# Altium schematic sheet QuadOPTOascii.SchDoc
size 513 x 386 mm
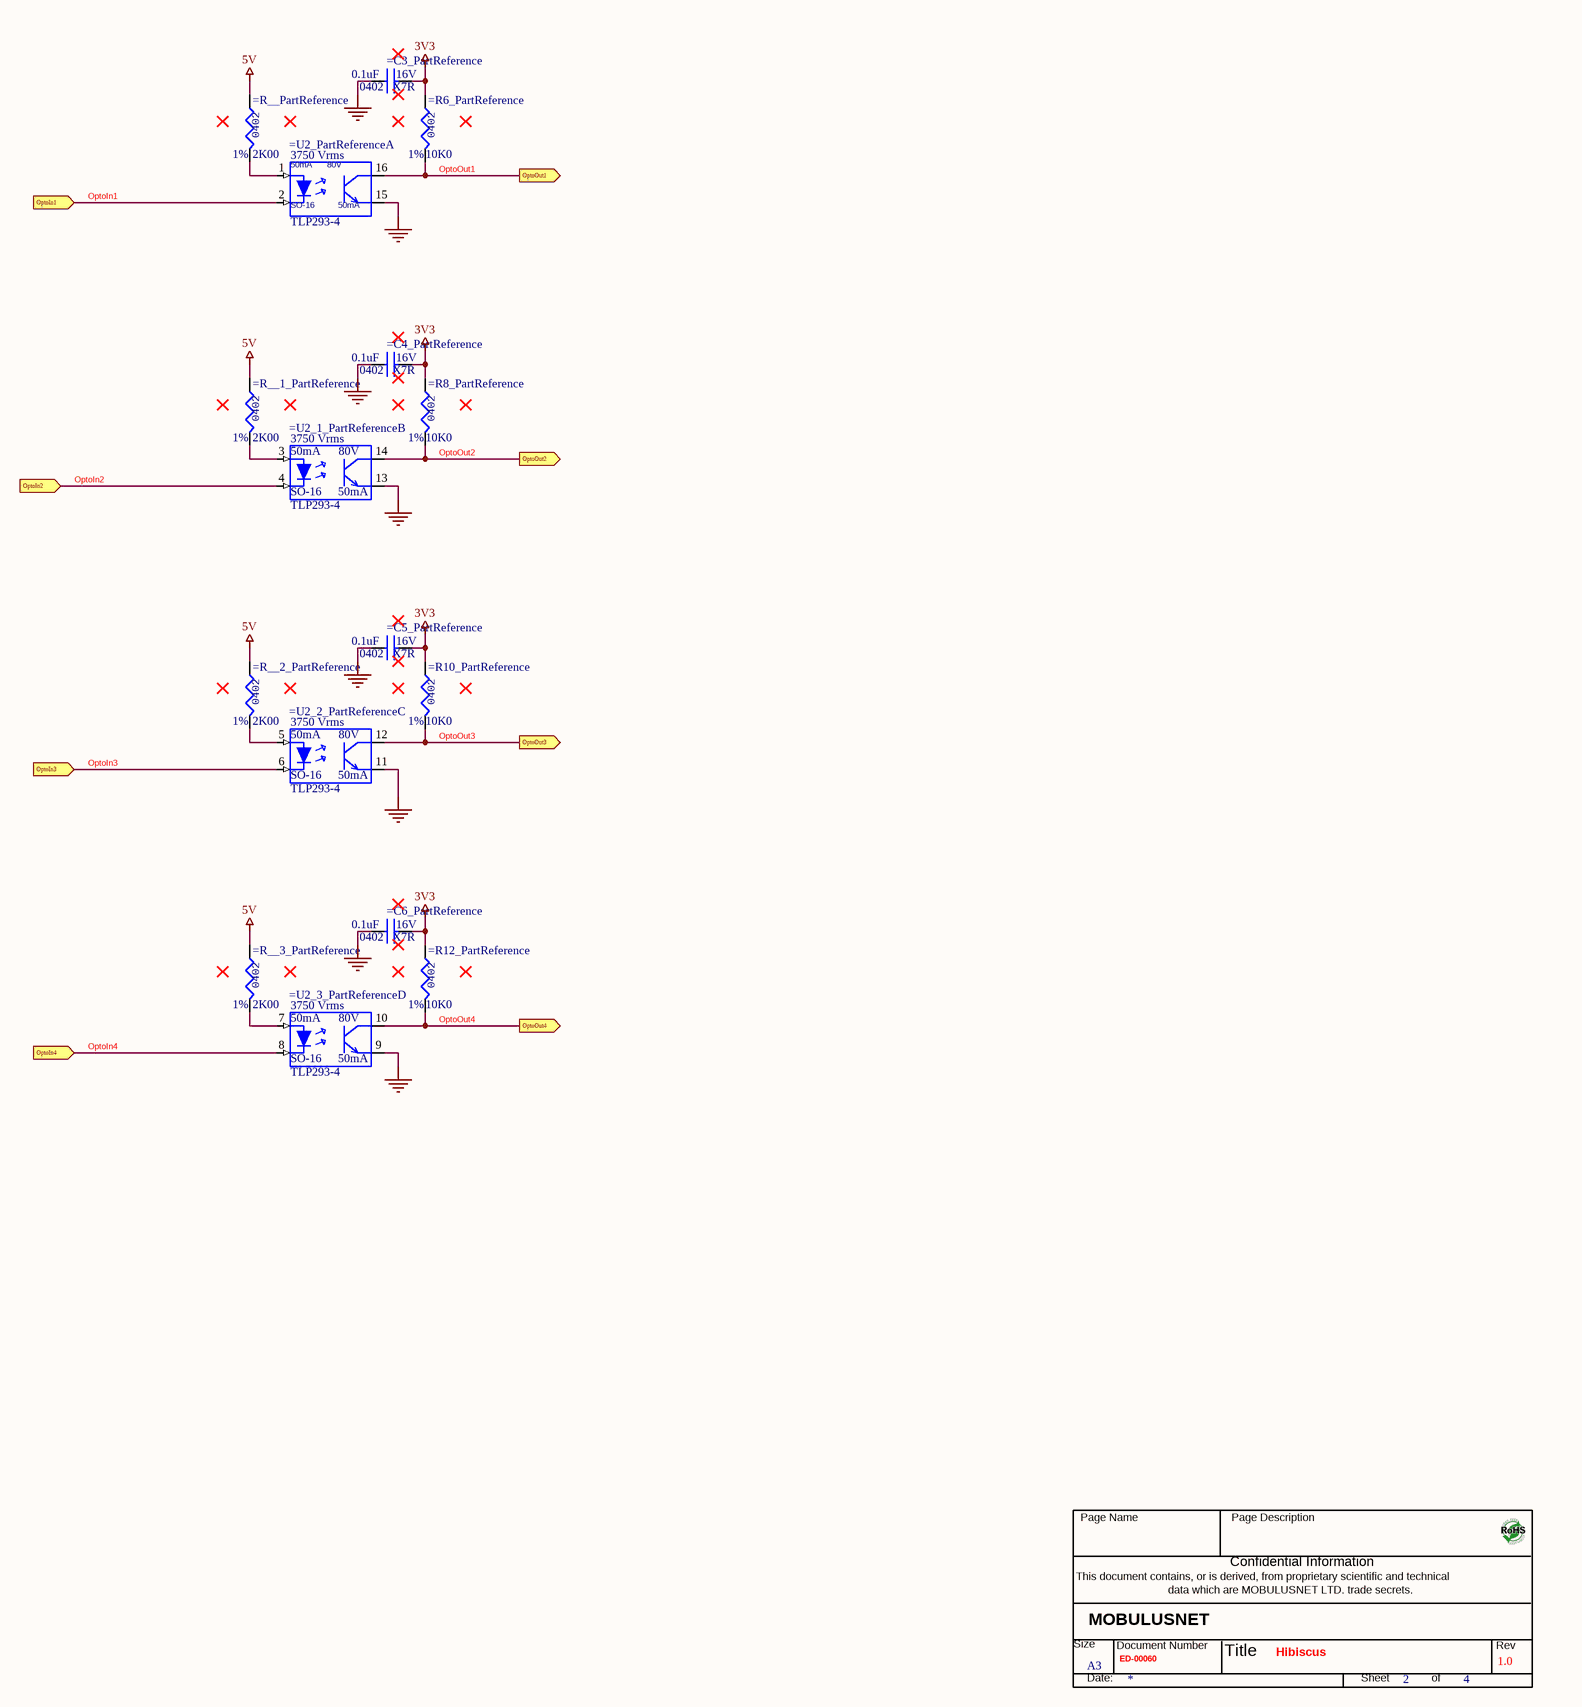
[diagram p0: QuadOPTOascii.SchDoc]

## Parts
*  Title: Hibiscus  RevCode: 1.0  Page Size: A3  Page Number: 2  Page Count: 4  Doc: ED-00060  (hidden comment: MobulusTitleBlock)  (graphical)
=C3_PartReference  0.1uF  VOLTAGE: 16V  PCBFootPrint: 0402   X7R  [0402]
=C4_PartReference  0.1uF  VOLTAGE: 16V  PCBFootPrint: 0402   X7R  [0402]
=C5_PartReference  0.1uF  VOLTAGE: 16V  PCBFootPrint: 0402   X7R  [0402]
=C6_PartReference  0.1uF  VOLTAGE: 16V  PCBFootPrint: 0402   X7R  [0402]
=R6_PartReference  10K0  Tolerance: 1%  [0402]
=R8_PartReference  10K0  Tolerance: 1%  [0402]
=R10_PartReference  10K0  Tolerance: 1%  [0402]
=R12_PartReference  10K0  Tolerance: 1%  [0402]
=R__1_PartReference  2K00  Tolerance: 1%  [0402]
=R__2_PartReference  2K00  Tolerance: 1%  [0402]
=R__3_PartReference  2K00  Tolerance: 1%  [0402]
=R__PartReference  2K00  Tolerance: 1%  [0402]
=U2_1_PartReference  TLP293-4  Power: 50mA      80V  ISO: 3750 Vrms  FootPrint: SO-16  Current Power: 50mA  [SO-16_TLP293-4]  (part B of 4)
=U2_2_PartReference  TLP293-4  Power: 50mA      80V  ISO: 3750 Vrms  FootPrint: SO-16  Current Power: 50mA  [SO-16_TLP293-4]  (part C of 4)
=U2_3_PartReference  TLP293-4  Power: 50mA      80V  ISO: 3750 Vrms  FootPrint: SO-16  Current Power: 50mA  [SO-16_TLP293-4]  (part D of 4)
=U2_PartReference  TLP293-4  Power: 50mA      80V  ISO: 3750 Vrms  FootPrint: SO-16  Current Power: 50mA  [SO-16_TLP293-4]  (part A of 4)

## Ports
OptoIn1 (in), OptoIn2 (in), OptoIn3 (in), OptoIn4 (in), OptoOut1 (out), OptoOut2 (out), OptoOut3 (out), OptoOut4 (out)

## Nets
3V3: =C3_PartReference.2 =C4_PartReference.2 =C5_PartReference.2 =C6_PartReference.2 =R6_PartReference.1 =R8_PartReference.1 =R10_PartReference.1 =R12_PartReference.1
5V: =R__1_PartReference.1 =R__2_PartReference.1 =R__3_PartReference.1 =R__PartReference.1
GND: =C3_PartReference.1 =C4_PartReference.1 =C5_PartReference.1 =C6_PartReference.1 =U2_1_PartReference.13(E) =U2_2_PartReference.11(E) =U2_3_PartReference.9(E) =U2_PartReference.15(E)
OptoIn1: =U2_PartReference.2(K) ; port OptoIn1
OptoIn2: =U2_1_PartReference.4(K) ; port OptoIn2
OptoIn3: =U2_2_PartReference.6(K) ; port OptoIn3
OptoIn4: =U2_3_PartReference.8(K) ; port OptoIn4
OptoOut1: =R6_PartReference.2 =U2_PartReference.16(C) ; port OptoOut1
OptoOut2: =R8_PartReference.2 =U2_1_PartReference.14(C) ; port OptoOut2
OptoOut3: =R10_PartReference.2 =U2_2_PartReference.12(C) ; port OptoOut3
OptoOut4: =R12_PartReference.2 =U2_3_PartReference.10(C) ; port OptoOut4
Net=R__1_PartReference_2: =R__1_PartReference.2 =U2_1_PartReference.3(A)
Net=R__2_PartReference_2: =R__2_PartReference.2 =U2_2_PartReference.5(A)
Net=R__3_PartReference_2: =R__3_PartReference.2 =U2_3_PartReference.7(A)
Net=R__PartReference_2: =R__PartReference.2 =U2_PartReference.1(A)

## Notes on the sheet
- (in symbol MobulusTitleBlock) Page Name; Page Description; Confidential Information; This document contains, or is derived, from proprietary scientific and technical; data which are MOBULUSNET LTD. trade secrets.; MOBULUSNET; Size; Document Number; Rev; Title; Date:; Sheet; of
- (in symbol R0402_2K00_1%) 0402
- (in symbol R0402_10K0_1%) 0402

## Library data of the parts
=C3_PartReference =C4_PartReference =C5_PartReference =C6_PartReference = CAP0402_0.1uF 16V: CAP_CER_0.1uF_16V_X7R_0402; Part Number: CC0402KRX7R7BB104; NO_XNET_CONNECTION: True; OVPN: OVCC00002; MFG: Yageo; ALT_SYMBOLS_HARD: 0402_RND; TYPE: X7R; ALT_SYMBOLS: 0402_RND; PCB Footprint: 0402
=R6_PartReference =R8_PartReference =R10_PartReference =R12_PartReference = R0402_10K0_1%: RES SMD 10K OHM 1% 1/16W 0402; Part Number: RC0402FR-0710KL; NO_XNET_CONNECTION: True; OVPN: OVRS00009; MFG: Yageo; Power: 1/16W; MOUNTING: SMT
=R__1_PartReference =R__2_PartReference =R__3_PartReference =R__PartReference = R0402_2K00_1%: RES SMD 2K OHM 1% 1/16W 0402; Part Number: RC0402FR-072KL; NO_XNET_CONNECTION: True; OVPN: OVRS00069; MFG: Yageo; Power: 1/16W; MOUNTING: SMT
=U2_1_PartReference =U2_2_PartReference =U2_3_PartReference =U2_PartReference = TLP293-4: OPTOISOLATOR 3.75KV TRANS SO16; PART NUMBER: TLP293-4(V4,E; OVPN: OVIC00228; MFG: Toshiba Semiconductor and Storage; PCB Footprint: SO-16_TLP293-4
* = MobulusTitleBlock: Page Create Date: March  8, 1995; Page Modify Date: *; Page_Number: =TitleBlock_Page_Number; Schematic_Page_Number: =TitleBlock_Schematic_Page_Number; Schematic_Page_Count: =TitleBlock_Schematic_Page_Count